# Altium schematic sheet Mainboard_V1.0_GPS.SchDoc: Mainboard
size A4; PageSetup: Record=PageOptions|CenterHorizontal=True|CenterVertical=True|PrintScale=0.97|XCorrection=1.00|YCorrection=1.00|PrintKind=0|BorderSize=5000000|LeftOffset=0|BottomOffset=0|Orientation=2|PaperLength=1000|PaperWidth=1000|Scale=100|PaperSource=7|PrintQuality=-3|MediaType=1|DitherType=10|PrintScaleMode=1|PaperKind=A4|PaperIndex=9; Organization: Ostschweizer Fachhochschule; Address2: Florian Baumgartner & Thierry Schwaller; Address3: florian.baumgartner@ost.ch; DocumentNumber: 5; Revision: V1.0; SheetNumber: 5; SheetTotal: 7; Author: Florian Baumgartner & Alain Keller; Subtitle: GPS
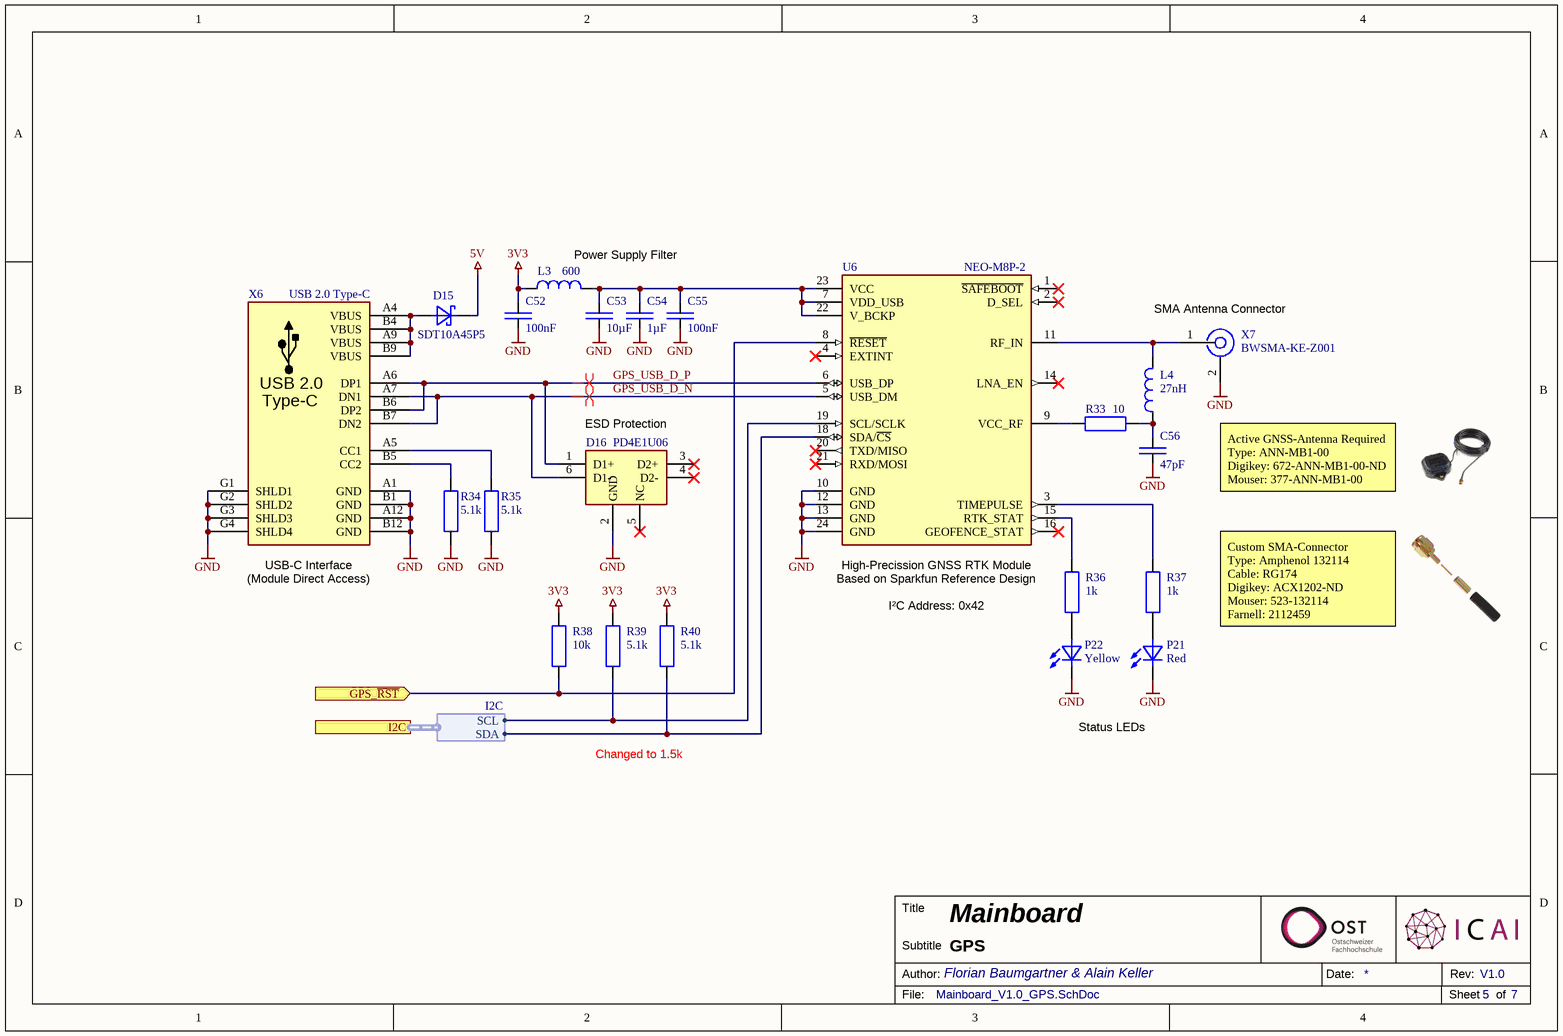
[diagram p0: Mainboard_V1.0_GPS.SchDoc]

## Parts
C52  100nF  [SMD Keramikkondensator 0603]
C53  10µF  [SMD Keramikkondensator 1206]
C54  1µF  [SMD Keramikkondensator 0603]
C55  100nF  [SMD Keramikkondensator 0603]
C56  47pF  [SMD Keramikkondensator 0603]
D15  SDT10A45P5  [SMD Diode PowerDI-5]
D16  PD4E1U06  [SMD IC SOT-363 (SC-70-6)]
L3  600  [SMD INDUCTOR/FERRITE 0805]
L4  27nH  [SMD Inductor 0402]
P21  Red  [SMD LED 0603]
P22  Yellow  [SMD LED 0603]
R33  10  [SMD Widerstand 0603]
R34  5.1k  [SMD Widerstand 0603]
R35  5.1k  [SMD Widerstand 0603]
R36  1k  [SMD Widerstand 0603]
R37  1k  [SMD Widerstand 0603]
R38  10k  [SMD Widerstand 0603]
R39  5.1k  [SMD Widerstand 0603]
R40  5.1k  [SMD Widerstand 0603]
U6  NEO-M8P-2  [SMD NEO-M8P-2]
X6  USB 2.0 Type-C  [THT USB-C Socket (KH-TYPE-C-L10-14P)]
X7  BWSMA-KE-Z001  [THT SMA-Connector (Vertical)]

## Ports
GPS_~{RST} (in), I2C (harness I2C)

## Harnesses
I2C: SCL, SDA

## Nets
3V3: C52.1 L3.1 R38.2 R39.1 R40.1
5V: D15.K
GND: C52.2 C53.1 C54.1 C55.2 C56.2 D16.2(GND) P21.K P22.K R34.2 R35.2 U6.10(GND) U6.12(GND) U6.13(GND) U6.24(GND) X6.A1(GND) X6.A12(GND) X6.B1(GND) X6.B12(GND) X6.G1(SHLD1) X6.G2(SHLD2) X6.G3(SHLD3) X6.G4(SHLD4) X7.2
GPS_~{RST}: R38.1 U6.8(~{RESET}) ; port GPS_~{RST}
GPS_USB_D_N: D16.6(D1-) U6.5(USB_DM) X6.A7(DN1) X6.B7(DN2)
GPS_USB_D_P: D16.1(D1+) U6.6(USB_DP) X6.A6(DP1) X6.B6(DP2)
NetC53_2: C53.2 C54.2 C55.1 L3.2 U6.7(VDD_USB) U6.22(V_BCKP) U6.23(VCC)
NetC56_1: C56.1 L4.1 R33.2
NetD15_A: D15.A X6.A4(VBUS) X6.A9(VBUS) X6.B4(VBUS) X6.B9(VBUS)
NetL4_2: L4.2 U6.11(RF_IN) X7.1
NetP21_A: P21.A R37.1
NetP22_A: P22.A R36.1
NetR33_1: R33.1 U6.9(VCC_RF)
NetR34_1: R34.1 X6.B5(CC2)
NetR35_1: R35.1 X6.A5(CC1)
NetR36_2: R36.2 U6.15(RTK_STAT)
NetR37_2: R37.2 U6.3(TIMEPULSE)
NetR39_2: R39.2 U6.19(SCL/SCLK) ; port I2C.SCL
NetR40_2: R40.2 U6.18(SDA/~{CS}) ; port I2C.SDA

Not connected (* = marked no-connect by the designer): D16 3(D2+)* 4(D2-)* 5(NC)*; U6 1(~{SAFEBOOT})* 2(D_SEL)* 4(EXTINT)* 14(LNA_EN)* 16(GEOFENCE_STAT)* 17(RESERVED) 20(TXD/MISO)* 21(RXD/MOSI)*

## Layout directives
differential pair: GPS_USB_D_N, GPS_USB_D_P

## Notes on the sheet
- (near L3) Power Supply Filter
- (near X7) SMA Antenna Connector
- (near D16) ESD Protection
- Active GNSS-Antenna Required
  Type: ANN-MB1-00
  Digikey: 672-ANN-MB1-00-ND
  Mouser: 377-ANN-MB1-00
- (near X6) USB-C Interface
- (near X6) (Module Direct Access)
- Based on Sparkfun Reference Design
- High-Precission GNSS RTK Module
- I²C Address: 0x42
- Custom SMA-Connector
  Type: Amphenol 132114
  Cable: RG174
  Digikey: ACX1202-ND
  Mouser: 523-132114
  Farnell: 2112459
- Changed to 1.5k
- Status LEDs
- Title
- Author:
- Subtitle
- Date:
- Rev:
- File:
- Sheet
- of
- (in symbol X-USB-Buchse_Vertical) USB 2.0

## Library data of the parts
C52 C55 = E6 - 100nF: SMD Ceramic Capacitor E6; Component Value: 100nF 50V; Component Description: Multilayer Ceramic Capacitors; ComponentLink1Description: Datasheet; ComponentLink1URL: https://datasheet.lcsc.com/lcsc/1809301912_YAGEO-CC0603KRX7R9BB104_C14663.pdf; Digikey: 445-5666-1-ND; Farnell: 2522432; JLC-Parts: C14663; Mouser: 77-VJ0603V104ZXAPBC; Unit Price: 0.01
C53 = E6 - 10uF: SMD Ceramic Capacitor E6; Component Value: 10µF 50V; Component Description: Multilayer Ceramic Capacitors MLCC; ComponentLink1Description: Datasheet; ComponentLink1URL: https://datasheet.lcsc.com/lcsc/1810191219_Samsung-Electro-Mechanics-CL10A106KP8NNNC_C19702.pdf; Digikey: 587-3258-1-ND; Farnell: 2113070; JLC-Parts: C13585; Mouser: 963-LMK107BBJ106MALT; Unit Price: 0.01
C54 = E6 - 1uF: SMD Ceramic Capacitor E6; Component Value: 1µF 50V; Component Description: Multilayer Ceramic Capacitors MLCC; ComponentLink1Description: Datasheet; ComponentLink1URL: https://datasheet.lcsc.com/lcsc/1810261812_Samsung-Electro-Mechanics-CL10A105KB8NNNC_C15849.pdf; Digikey: 1276-1860-1-ND; Farnell: 3013383; JLC-Parts: C15849; Mouser: 187-CL10A105KB8NNNC; Unit Price: 0.01
C56 = C-CAPACITOR: CAP-MK; Component Description: Multilayer Ceramic Capacitors; Component Value: 47pF 50V; Digikey: 399-C0603C470J5GAC7867CT-ND; Farnell: 1414639; Mouser: 80-C0603C470J5G; JLC-Parts: C1671; Unit Price: 0.01
D15 = R-DIODE:SCHKY: Trench Schottky Barrier Rectifier; Component Value: SDT10A45P5-13; Mouser: 621-SDT10A45P5-13; Farnell: 3944970; Digikey: 31-SDT10A45P5-13CT-ND; JLC-Parts: C2997843; Component Description: Trench Schottky Barrier Rectifier; Unit Price: 0.19; ComponentLink1Description: Datasheet; ComponentLink1URL: https://www.diodes.com/assets/Datasheets/SDT10A45P5.pdf
D16 = PD4E1U06DCKR: Unidirectional 3A (8/20us) 15V (Typ) 6.5V 5.5V (Max) SOT-363 ESD Protection Devices ROHS; Component Description: ESD Suppressor; ComponentLink1Description: Datasheet; ComponentLink1URL: https://datasheet.lcsc.com/lcsc/1810172210_Texas-Instruments-TPD4E1U06DCKR_C194628.pdf; Component Value: PD4E1U06; Digikey: 296-39347-1-ND; Farnell: 3116516; JLC-Parts: C194628; Mouser: 595-TPD4E1U06DCKR; Unit Price: 0.12
L3 = R-COIL (HF): COIL (Spule alt L); Component Description: Ferrite Bead; Component Value: CBM201209U601T (600 Ohm@100MHz, 2000mA); Farnell: 1838838; Mouser: 623-2508056017Y2; Digikey: 1934-1487-1-ND; ComponentLink1Description: Datasheet; ComponentLink1URL: https://datasheet.lcsc.com/lcsc/2304140030_FH--Guangdong-Fenghua-Advanced-Tech-CBM201209U601T_C139168.pdf; JLC-Parts: C139168; Unit Price: 0.01
L4 = R-COIL (HF): Chip Inductor; Farnell: 1404304; Mouser: 81-LQG15HS27NJ02D; Digikey: 490-2628-1-ND; Component Description: Chip Inductor; Component Value: 27nH; JLC-Parts: C12669; Unit Price: 0.01
P21 = P-LED: LED (als Lampe E / alt H); Component Description: General Purpose LED; Component Value: Red (5mA, 2.0V); Digikey: 350-2029-1-ND; Farnell: 1465988; Mouser: 645-598-8010-107F; ComponentLink1Description: Datasheet; ComponentLink1URL: https://datasheet.lcsc.com/szlcsc/Hubei-KENTO-Elec-KT-0603R_C2286.pdf; JLC-Parts: C2286; Unit Price: 0.34
P22 = P-LED: LED (als Lampe E / alt H); Component Description: General Purpose LED; Component Value: Yellow (5mA, 2.1V); Digikey: 350-2033-1-ND; Farnell: 1867103; Mouser: 645-598-8050-107F; ComponentLink1Description: Datasheet; ComponentLink1URL: https://datasheet.lcsc.com/szlcsc/Everlight-Elec-19-213-Y2C-CQ2R2L-3T-CY_C72038.pdf; JLC-Parts: C72038; Unit Price: 0.34
R33 = R-RESISTOR: RES (E=Heizwiderstand B=Messwandler); Component Description: Thick Film Chip Resistor; Component Value: 10 (75V, 100mW, 1%); Digikey: P10.0HCT-ND; Farnell: 2302958; Mouser: 667-ERJ-3EKF10R0V; JLC-Parts: C22859; Unit Price: 0.01
R34 R35 R39 R40 = R-RESISTOR: RES (E=Heizwiderstand B=Messwandler); Component Description: Thick Film Chip Resistor; Component Value: 5.1k (75V, 100mW, 1%); Digikey: P5.10KHCT-ND; Farnell: 2059378; Mouser: 667-ERJ-3EKF5101V; JLC-Parts: C23186; Unit Price: 0.01
R36 R37 = R-RESISTOR: RES (E=Heizwiderstand B=Messwandler); Component Description: Dickschicht Chipwiderstand; Component Value: 1k (75V, 100mW, 1%); Digikey: P1.00KHCT-ND; Farnell: 2303145; Mouser: 667-ERJ-3EKF1001V; JLC-Parts: C21190; Unit Price: 0.01
R38 = R-RESISTOR: RES (E=Heizwiderstand B=Messwandler); Component Description: Thick Film Chip Resistor; Component Value: 10k (75V, 100mW, 1%); Digikey: P10.0KHCT-ND; Farnell: 2303192; Mouser: 667-ERJ-3EKF1002V; JLC-Parts: C25804; Unit Price: 0.01
U6 = U-NEO-M8P-2: High Precision GNSS Module (GPS-RTK); ComponentLink1Description: Datasheet; ComponentLink1URL: https://content.u-blox.com/sites/default/files/NEO-M8P_DataSheet_UBX-15016656.pdf; Digikey: 672-NEO-M8P-2CT-ND; Component Value: NEO-M8P-2; Mouser: 377-NEO-M8P-2; Unit Price: 134.10; Component Description: High Precision GNSS Module (GPS-RTK)
X6 = X-USB-Buchse_Vertical: Type-C; aliExpress: 1005003021508194; Component Description: USB Connector Type-C Vertical; Component Value: KH-TYPE-C-L10-14P; ComponentLink1Description: Datasheet; ComponentLink1URL: https://datasheet.lcsc.com/lcsc/2103161911_Shenzhen-Kinghelm-Elec-KH-TYPE-C-L10-14P_C2761226.pdf; JLC-Parts: C2761226; Unit Price: 0.27
X7 = X-SMA-Connector: SMA Connector; Digikey: SAM8971-ND; Farnell: 2856821; Mouser: 200-SMAJPHSTTH1; Component Description: SMA Connector; ComponentLink1Description: Datasheet; ComponentLink1URL: https://datasheet.lcsc.com/lcsc/2212281109_BAT-WIRELESS-BWSMA-KE-Z001_C496549.pdf; Component Value: BWSMA-KE-Z001; JLC-Parts: C496549; Unit Price: 0.30